# EAGLE design ADC Board(Two Board) (EAGLE 7.6.0)
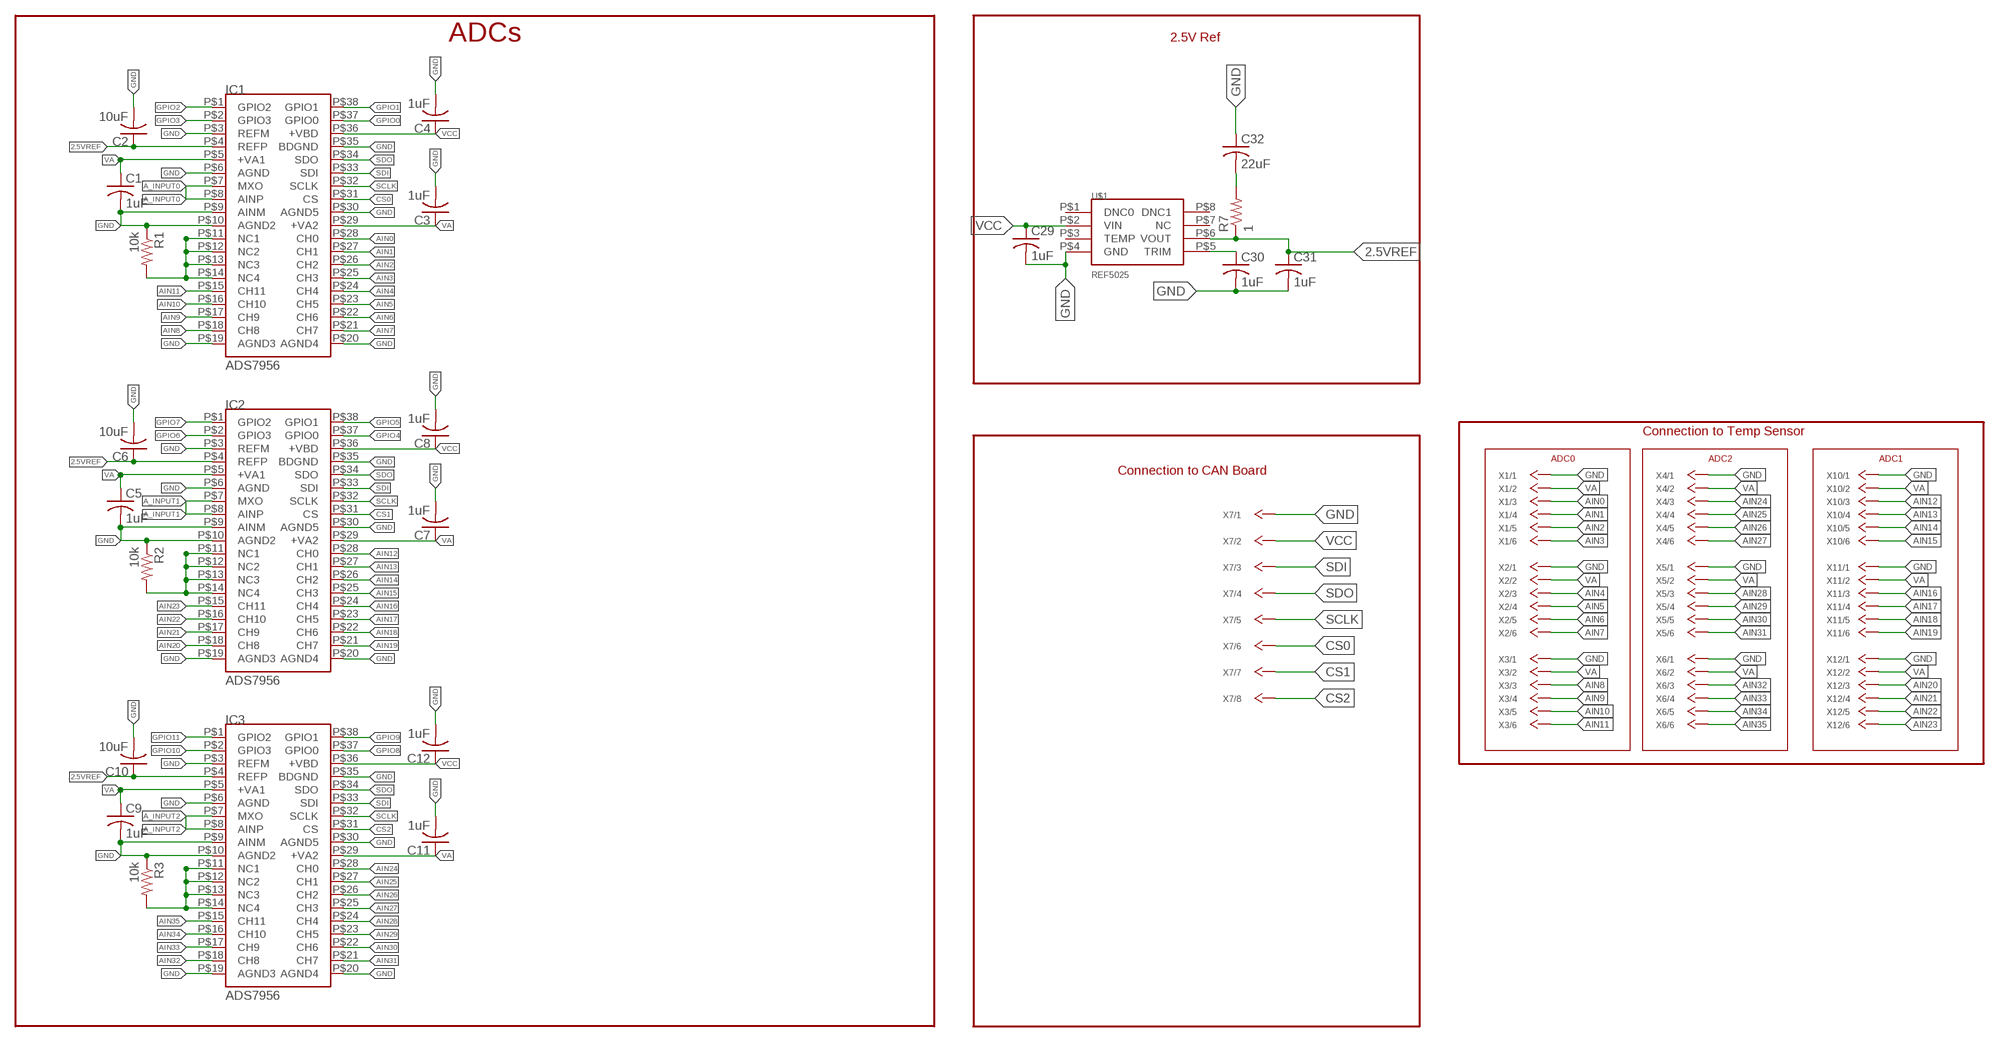
[diagram p0: schematic, sheet 1]

## Parts
C1  1uF  C-USC0603  [C0603]
C2  10uF  C-USC0603  [C0603]
C3  1uF  C-USC0603  [C0603]
C4  1uF  C-USC0603  [C0603]
C5  1uF  C-USC0603  [C0603]
C6  10uF  C-USC0603  [C0603]
C7  1uF  C-USC0603  [C0603]
C8  1uF  C-USC0603  [C0603]
C9  1uF  C-USC0603  [C0603]
C10  10uF  C-USC0603  [C0603]
C11  1uF  C-USC0603  [C0603]
C12  1uF  C-USC0603  [C0603]
C29  1uF  C-USC0603  [C0603]
C30  1uF  C-USC0603  [C0603]
C31  1uF  C-USC0603  [C0603]
C32  22uF  C-USC0603  [C0603]
IC1  ADS7956  [TSSOP-38]
IC2  ADS7956  [TSSOP-38]
IC3  ADS7956  [TSSOP-38]
R1  10k  R-US_R0603  [R0603]
R2  10k  R-US_R0603  [R0603]
R3  10k  R-US_R0603  [R0603]
R7  1  R-US_M0805  [M0805]
U$1  REF5025  [TSSOP-8(TI)]
X1  6_PIN_CONNTE_IDC  [2178710_IDC]
X2  6_PIN_CONNTE_IDC  [2178710_IDC]
X3  6_PIN_CONNTE_IDC  [2178710_IDC]
X4  6_PIN_CONNTE_IDC  [2178710_IDC]
X5  6_PIN_CONNTE_IDC  [2178710_IDC]
X6  6_PIN_CONNTE_IDC  [2178710_IDC]
X7  8_PIN_CONN  [8_PIN_MOLEX]
X10  6_PIN_CONNTE_IDC  [2178710_IDC]
X11  6_PIN_CONNTE_IDC  [2178710_IDC]
X12  6_PIN_CONNTE_IDC  [2178710_IDC]

## Nets
2.5VREF: C2.1 C6.1 C10.1 C31.1 IC1.P$4(REFP) IC2.P$4(REFP) IC3.P$4(REFP) R7.1 U$1.P$6(VOUT)
A_INPUT0: IC1.P$7(MXO) IC1.P$8(AINP)
A_INPUT1: IC2.P$7(MXO) IC2.P$8(AINP)
A_INPUT2: IC3.P$7(MXO) IC3.P$8(AINP)
AIN0: IC1.P$28(CH0) X1.P$3
AIN1: IC1.P$27(CH1) X1.P$4
AIN2: IC1.P$26(CH2) X1.P$5
AIN3: IC1.P$25(CH3) X1.P$6
AIN4: IC1.P$24(CH4) X2.P$3
AIN5: IC1.P$23(CH5) X2.P$4
AIN6: IC1.P$22(CH6) X2.P$5
AIN7: IC1.P$21(CH7) X2.P$6
AIN8: IC1.P$18(CH8) X3.P$3
AIN9: IC1.P$17(CH9) X3.P$4
AIN10: IC1.P$16(CH10) X3.P$5
AIN11: IC1.P$15(CH11) X3.P$6
AIN12: IC2.P$28(CH0) X10.P$3
AIN13: IC2.P$27(CH1) X10.P$4
AIN14: IC2.P$26(CH2) X10.P$5
AIN15: IC2.P$25(CH3) X10.P$6
AIN16: IC2.P$24(CH4) X11.P$3
AIN17: IC2.P$23(CH5) X11.P$4
AIN18: IC2.P$22(CH6) X11.P$5
AIN19: IC2.P$21(CH7) X11.P$6
AIN20: IC2.P$18(CH8) X12.P$3
AIN21: IC2.P$17(CH9) X12.P$4
AIN22: IC2.P$16(CH10) X12.P$5
AIN23: IC2.P$15(CH11) X12.P$6
AIN24: IC3.P$28(CH0) X4.P$3
AIN25: IC3.P$27(CH1) X4.P$4
AIN26: IC3.P$26(CH2) X4.P$5
AIN27: IC3.P$25(CH3) X4.P$6
AIN28: IC3.P$24(CH4) X5.P$3
AIN29: IC3.P$23(CH5) X5.P$4
AIN30: IC3.P$22(CH6) X5.P$5
AIN31: IC3.P$21(CH7) X5.P$6
AIN32: IC3.P$18(CH8) X6.P$3
AIN33: IC3.P$17(CH9) X6.P$4
AIN34: IC3.P$16(CH10) X6.P$5
AIN35: IC3.P$15(CH11) X6.P$6
CS0: IC1.P$31(CS) X7.P$6
CS1: IC2.P$31(CS) X7.P$7
CS2: IC3.P$31(CS) X7.P$8
GND: C1.2 C2.2 C3.2 C4.2 C5.2 C6.2 C7.2 C8.2 C9.2 C10.2 C11.2 C12.2 C29.2 C30.2 C31.2 C32.1 IC1.P$3(REFM) IC1.P$6(AGND) IC1.P$9(AINM) IC1.P$10(AGND2) IC1.P$19(AGND3) IC1.P$20(AGND4) IC1.P$30(AGND5) IC1.P$35(BDGND) IC2.P$3(REFM) IC2.P$6(AGND) IC2.P$9(AINM) IC2.P$10(AGND2) IC2.P$19(AGND3) IC2.P$20(AGND4) IC2.P$30(AGND5) IC2.P$35(BDGND) IC3.P$3(REFM) IC3.P$6(AGND) IC3.P$9(AINM) IC3.P$10(AGND2) IC3.P$19(AGND3) IC3.P$20(AGND4) IC3.P$30(AGND5) IC3.P$35(BDGND) R1.1 R2.1 R3.1 U$1.P$4(GND) X1.P$1 X2.P$1 X3.P$1 X4.P$1 X5.P$1 X6.P$1 X7.P$1 X10.P$1 X11.P$1 X12.P$1
GPIO0: IC1.P$37(GPIO0)
GPIO1: IC1.P$38(GPIO1)
GPIO2: IC1.P$1(GPIO2)
GPIO3: IC1.P$2(GPIO3)
GPIO4: IC2.P$37(GPIO0)
GPIO5: IC2.P$38(GPIO1)
GPIO6: IC2.P$2(GPIO3)
GPIO7: IC2.P$1(GPIO2)
GPIO8: IC3.P$37(GPIO0)
GPIO9: IC3.P$38(GPIO1)
GPIO10: IC3.P$2(GPIO3)
GPIO11: IC3.P$1(GPIO2)
N$3: C32.2 R7.2
NC: IC1.P$11(NC1) IC1.P$12(NC2) IC1.P$13(NC3) IC1.P$14(NC4) R1.2
NC1: IC2.P$11(NC1) IC2.P$12(NC2) IC2.P$13(NC3) IC2.P$14(NC4) R2.2
NC2: IC3.P$11(NC1) IC3.P$12(NC2) IC3.P$13(NC3) IC3.P$14(NC4) R3.2
SCLK: IC1.P$32(SCLK) IC2.P$32(SCLK) IC3.P$32(SCLK) X7.P$5
SDI: IC1.P$33(SDI) IC2.P$33(SDI) IC3.P$33(SDI) X7.P$3
SDO: IC1.P$34(SDO) IC2.P$34(SDO) IC3.P$34(SDO) X7.P$4
TRIM: C30.1 U$1.P$5(TRIM)
VA: C1.1 C3.1 C5.1 C7.1 C9.1 C11.1 IC1.P$5(+VA1) IC1.P$29(+VA2) IC2.P$5(+VA1) IC2.P$29(+VA2) IC3.P$5(+VA1) IC3.P$29(+VA2) X1.P$2 X2.P$2 X3.P$2 X4.P$2 X5.P$2 X6.P$2 X10.P$2 X11.P$2 X12.P$2
VCC: C4.1 C8.1 C12.1 C29.1 IC1.P$36(+VBD) IC2.P$36(+VBD) IC3.P$36(+VBD) U$1.P$2(VIN) X7.P$2
Unconnected: U$1.P$1(DNC0) U$1.P$3(TEMP) U$1.P$7(NC) U$1.P$8(DNC1)

## Notes on the sheet
- ADCs | 2.5V Ref
- Connection to Temp Sensor
- ADC0 | ADC2 | ADC1
- Connection to CAN Board

## Library data of the parts
C1-C12 C29-C32 = adafruit:C-US: CAPACITOR, American symbol
IC1-IC3 = BMS Lbr:ADS7956
R1-R3 = resistor:R-US_: RESISTOR, American symbol
R7 = adafruit:R-US_: RESISTOR, American symbol
U$1 = BMS Lbr:REF5025: 2.5V Voltage Reference
X1-X6 X10-X12 = BMS Lbr:6_PIN_CONN: 6 Pin Connector
X7 = BMS Lbr:8_PIN_CONN

## Board
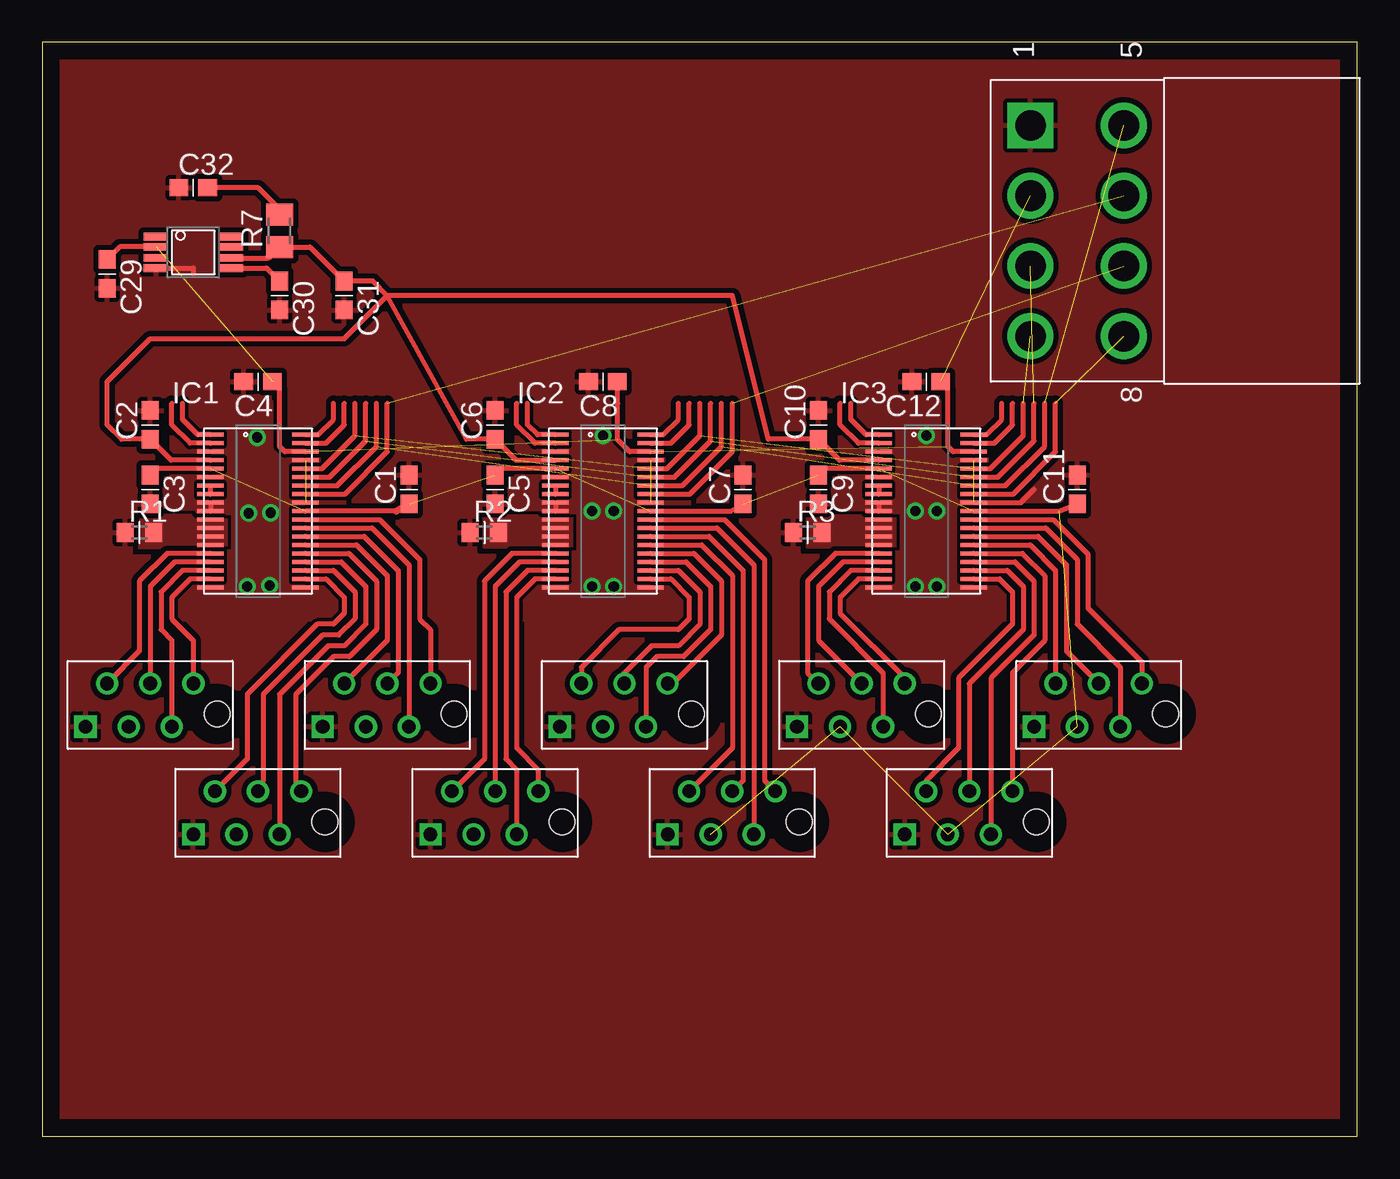
[diagram p1: board, top side]
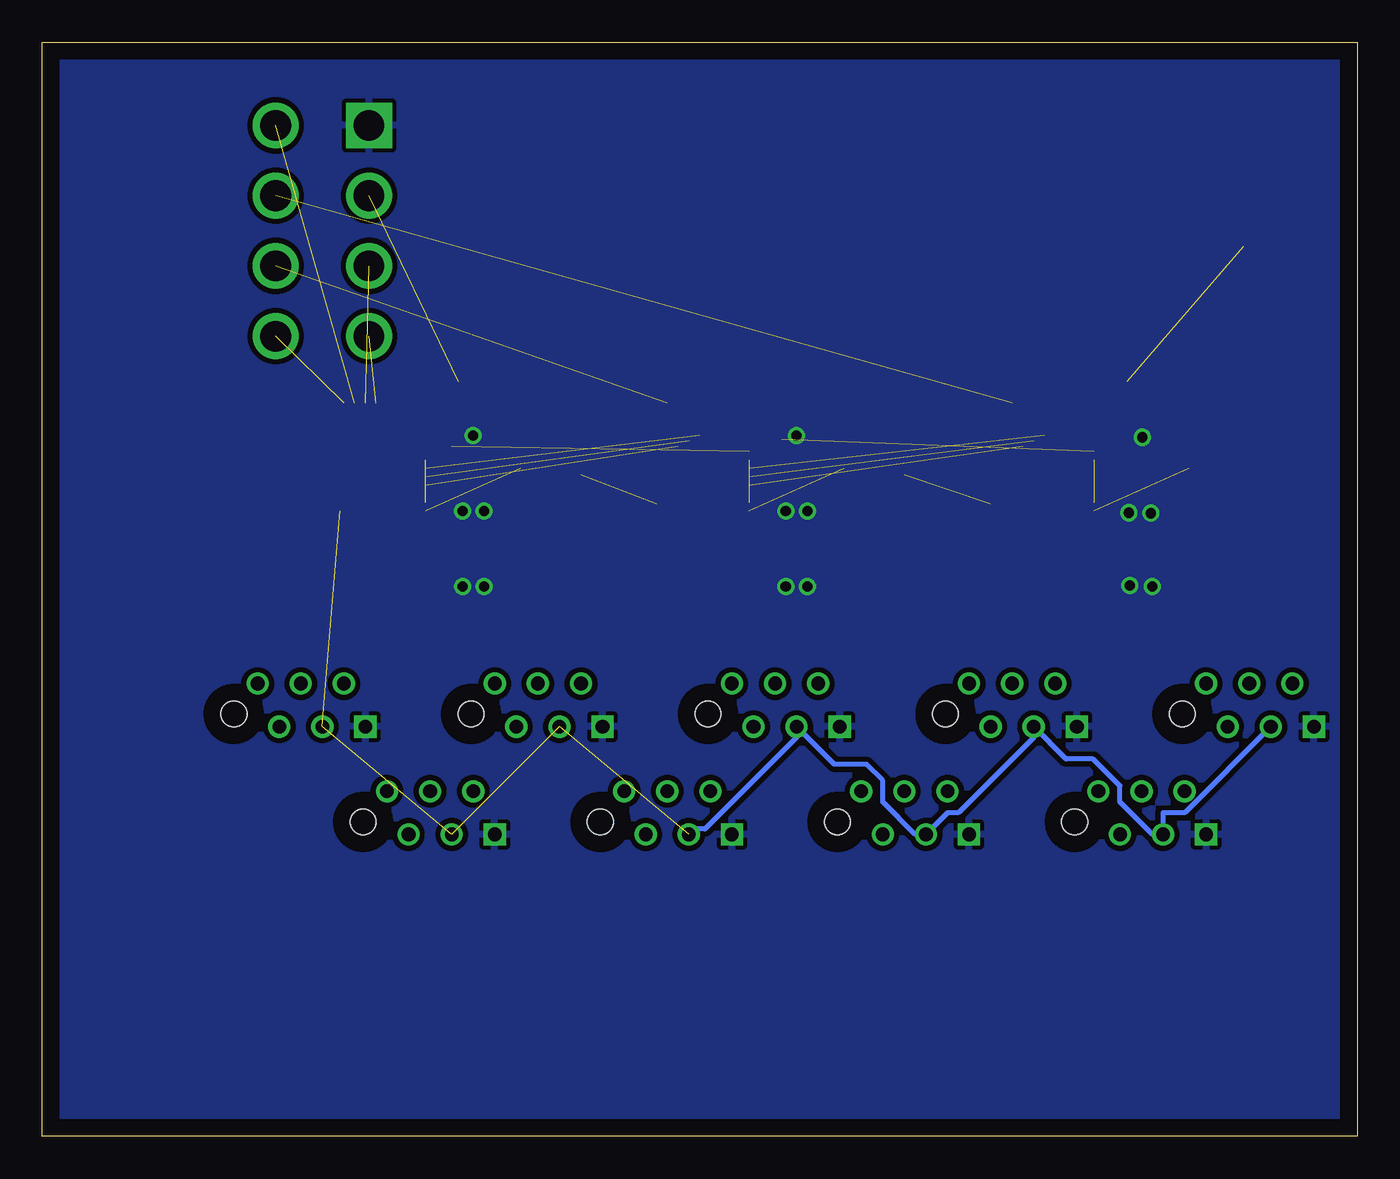
[diagram p2: board, bottom side, seen from below]

Size 77.45 x 64.44 mm. Coordinates in mm from the lower left corner, seen from the top.
Outline: 0,0 77.45,0 77.45,64.44 0,64.44 0,0
Copper layers (1*16): Top 0.035mm / dielectric 1.5mm / Bottom 0.035mm
Design rules "default": minimum track width 10mil, minimum drill 24mil, track to track 8mil, track to pad 8mil, pad to pad 8mil, via to via 8mil, smd to smd 8mil, copper to edge 40mil, drill to drill 8mil, minimum pad ring 10mil, minimum via ring 8mil, stop-mask expansion 4mil, vias tented up to drill 0mil, thermal gap 10mil

### Footprints (pad centres in the part's own frame; a part is rotated, then mirrored left to right if it is on the bottom)
C0603 = smd 1.1 x 1: 1 -0.85,0; 2 0.85,0
TSSOP-38 = smd 1.55 x 0.25: P$1 -2.8,4.5; P$2 -2.8,4; P$3 -2.8,3.5; P$4 -2.8,3; P$5 -2.8,2.5; P$6 -2.8,2; P$7 -2.8,1.5; P$8 -2.8,1; P$9 -2.8,0.5; P$10 -2.8,0; P$11 -2.8,-0.5; P$12 -2.8,-1; P$13 -2.8,-1.5; P$14 -2.8,-2; P$15 -2.8,-2.5; P$16 -2.8,-3; P$17 -2.8,-3.5; P$18 -2.8,-4; P$19 -2.8,-4.5; P$20 2.8,-4.5; P$21 2.8,-4; P$22 2.8,-3.5; P$23 2.8,-3; P$24 2.8,-2.5; P$25 2.8,-2; P$26 2.8,-1.5; P$27 2.8,-1; P$28 2.8,-0.5; P$29 2.8,0; P$30 2.8,0.5; P$31 2.8,1; P$32 2.8,1.5; P$33 2.8,2; P$34 2.8,2.5; P$35 2.8,3; P$36 2.8,3.5; P$37 2.8,4; P$38 2.8,4.5
R0603 = smd 1 x 1.1: 1 -0.85,0; 2 0.85,0
M0805 = smd 1.3 x 1.6: 1 -0.95,0; 2 0.95,0
TSSOP-8(TI) = smd 0.45 x 1.45: P$1 -0.925,-2.2; P$2 -0.325,-2.2; P$3 0.325,-2.2; P$4 0.925,-2.2; P$5 0.925,2.2; P$6 0.325,2.2; P$7 -0.325,2.2; P$8 -0.925,2.2
2178710_IDC = drill 0.8 square: P$1 -3.81,-2.54 | drill 0.8: P$2 -1.27,-2.54; P$3 2.54,0; P$4 1.27,-2.54; P$5 0,0; P$6 -2.54,0 | hole 1.5: 3.94,-1.8
8_PIN_MOLEX = drill 1.8 square: P$1 6.21,2.75 | drill 1.8: P$2 2.07,2.75; P$3 -2.07,2.75; P$4 -6.21,2.75; P$5 6.21,-2.75; P$6 2.07,-2.75; P$7 -2.07,-2.75; P$8 -6.21,-2.75

### Placement (x,y rotation side)
C1  21.59,38.1 90 top
C2  6.35,41.91 90 top
C3  6.35,38.1 270 top
C4  12.7,44.45 180 top
C5  26.67,38.1 270 top
C6  26.67,41.91 90 top
C7  41.27,38.1 90 top
C8  33.02,44.45 180 top
C9  45.72,38.1 270 top
C10  45.72,41.91 90 top
C11  60.96,38.1 90 top
C12  52.07,44.45 180 top
C29  3.81,50.8 270 top
C30  13.97,49.53 270 top
C31  17.78,49.53 270 top
C32  8.89,55.88 0 top
IC1  12.7,36.83 0 top
IC2  33.02,36.83 0 top
IC3  52.07,36.83 0 top
R1  5.71,35.56 0 top
R2  26.04,35.56 0 top
R3  45.09,35.56 0 top
R7  13.97,53.34 90 top
U$1  8.89,52.07 270 top
X1  20.32,26.67 0 top
X2  12.7,20.32 0 top
X3  6.35,26.67 0 top
X4  62.23,26.67 0 top
X5  54.61,20.32 0 top
X6  48.26,26.67 0 top
X7  60.96,53.34 90 top
X10  40.64,20.32 0 top
X11  34.29,26.67 0 top
X12  26.67,20.32 0 top

### Tracks (layer width: path | path; a pad name or v marks a point on that pad's centre or on a via)
2.5VREF
  Top 0.305: IC1.P$4 7.58,39.83 C2.1 4.66,41.06 3.81,41.91 3.81,44.45 6.35,46.99 17.78,46.99 20.32,49.53 | IC2.P$4 27.9,39.83 C6.1 24.98,41.06 20.32,49.53 | IC3.P$4 46.95,39.83 C10.1 42.76,41.06 40.64,49.53 20.32,49.53 | U$1.P$6 13.32,51.74 R7.1 15.77,52.39 C31.1 19.47,50.38 20.32,49.53
A_INPUT0
  Top 0.305: IC1.P$8 IC1.P$7
A_INPUT1
  Top 0.305: IC2.P$7 IC2.P$8
A_INPUT2
  Top 0.305: IC3.P$7 IC3.P$8
AIN0
  Top 0.305: IC1.P$28 19.87,36.33 22.23,33.97 22.23,30.48 22.86,29.84 X1.P$3
AIN1
  Top 0.305: IC1.P$27 19.41,35.83 21.59,33.66 X1.P$4
AIN2
  Top 0.305: IC1.P$26 18.96,35.33 20.95,33.34 20.95,27.3 X1.P$5
AIN3
  Top 0.305: IC1.P$25 18.51,34.83 20.32,33.02 20.32,29.21 X1.P$6
AIN4
  Top 0.305: IC1.P$24 18.06,34.33 19.68,32.7 19.68,29.84 18.1,28.26 17.14,28.26 14.92,26.04 14.92,20.64 X2.P$3
AIN5
  Top 0.305: IC1.P$23 17.61,33.83 19.05,32.38 19.05,30.16 17.78,28.89 16.83,28.89 13.97,26.04 X2.P$4
AIN6
  Top 0.305: IC1.P$22 17.15,33.33 18.41,32.07 18.41,30.48 17.46,29.53 16.51,29.53 13.02,26.04 13.02,20.95 12.7,20.64 X2.P$5
AIN7
  Top 0.305: IC1.P$21 16.7,32.83 17.78,31.75 17.78,30.8 17.14,30.16 16.19,30.16 12.06,26.04 12.06,22.23 X2.P$6
AIN8
  Top 0.305: IC1.P$18 8.7,32.83 7.62,31.75 7.62,30.48 8.89,29.21 X3.P$3
AIN9
  Top 0.305: IC1.P$17 8.25,33.33 6.99,32.07 6.99,29.84 7.62,29.21 X3.P$4
AIN10
  Top 0.305: IC1.P$16 7.79,33.83 6.35,32.38 X3.P$5
AIN11
  Top 0.305: IC1.P$15 7.34,34.33 5.71,32.7 5.71,28.57 X3.P$6
AIN12
  Top 0.305: IC2.P$28 40.19,36.33 42.55,33.97 42.55,20.95 X10.P$3
AIN13
  Top 0.305: IC2.P$27 39.73,35.83 41.91,33.66 X10.P$4
AIN14
  Top 0.305: IC2.P$26 39.28,35.33 41.27,33.34 41.27,20.95 X10.P$5
AIN15
  Top 0.305: IC2.P$25 38.83,34.83 40.64,33.02 40.64,22.86 X10.P$6
AIN16
  Top 0.305: IC2.P$24 38.38,34.33 40.01,32.7 40.01,29.53 37.15,26.67 X11.P$3
AIN17
  Top 0.305: IC2.P$23 37.92,33.83 39.37,32.38 39.37,29.84 37.78,28.26 36.2,28.26 35.56,27.62 X11.P$4
AIN18
  Top 0.305: IC2.P$22 37.47,33.33 38.73,32.07 38.73,30.16 37.47,28.89 35.88,28.89 34.29,27.3 X11.P$5
AIN19
  Top 0.305: IC2.P$21 37.02,32.83 38.1,31.75 38.1,30.48 37.47,29.84 33.97,29.84 31.75,27.62 X11.P$6
AIN20
  Top 0.305: IC2.P$18 29.02,32.83 27.94,31.75 27.94,22.86 29.21,21.59 X12.P$3
AIN21
  Top 0.305: IC2.P$17 28.57,33.33 27.3,32.07 27.3,22.23 27.94,21.59 X12.P$4
AIN22
  Top 0.305: IC2.P$16 28.11,33.83 26.67,32.38 X12.P$5
AIN23
  Top 0.305: IC2.P$15 27.66,34.33 26.04,32.7 26.04,22.23 X12.P$6
AIN24
  Top 0.305: IC3.P$28 59.55,36.33 61.59,34.29 61.59,31.11 64.77,27.94 X4.P$3
AIN25
  Top 0.305: IC3.P$27 59.1,35.83 60.96,33.97 60.96,30.16 63.5,27.62 X4.P$4
AIN26
  Top 0.305: IC3.P$26 58.65,35.33 60.33,33.66 60.33,28.57 X4.P$5
AIN27
  Top 0.305: IC3.P$25 58.2,34.83 59.69,33.34 X4.P$6
AIN28
  Top 0.305: IC3.P$24 57.74,34.33 59.05,33.02 59.05,29.21 57.15,27.3 X5.P$3
AIN29
  Top 0.305: IC3.P$23 57.29,33.83 58.42,32.7 58.42,29.53 55.88,26.99 X5.P$4
AIN30
  Top 0.305: IC3.P$22 56.84,33.33 57.78,32.38 57.78,29.84 54.61,26.67 X5.P$5
AIN31
  Top 0.305: IC3.P$21 56.39,32.83 57.15,32.07 57.15,30.16 53.98,26.99 53.98,22.86 52.07,20.95 X5.P$6
AIN32
  Top 0.305: IC3.P$18 48.07,32.83 46.99,31.75 46.99,30.8 50.8,26.99 X6.P$3
AIN33
  Top 0.305: IC3.P$17 47.62,33.33 46.35,32.07 46.35,30.48 49.53,27.3 X6.P$4
AIN34
  Top 0.305: IC3.P$16 47.16,33.83 45.72,32.38 45.72,29.21 X6.P$5
AIN35
  Top 0.305: IC3.P$15 46.71,34.33 45.09,32.7 45.09,27.3 X6.P$6
CS0  (1 unrouted)
  Top 0.305: IC1.P$31 17.83,37.83 20.32,40.32 20.32,43.18
CS1  (1 unrouted)
  Top 0.305: IC2.P$31 38.15,37.83 40.64,40.32 40.64,43.18
CS2  (1 unrouted)
  Top 0.305: IC3.P$31 57.2,37.83 59.69,40.32 59.69,43.18
GND  (via drill 0.6)  (3 unrouted)
  Top 0.305: IC2.P$9 IC2.P$10 | IC3.P$9 IC3.P$10 | IC1.P$9 IC1.P$10 | U$1.P$4 8.89,51.15 8.89,50.8 | IC3.P$30 57.65,37.33 58.42,38.1
  other vias: 12.06,32.38 13.39,32.44 12.14,36.7 13.44,36.73 12.65,41.17 32.38,32.38 33.66,32.38 32.38,36.83 33.66,36.83 33.02,41.27 51.44,32.38 52.7,32.38 52.7,36.83 51.44,36.83 52.07,41.27
  pour Top (rank 6, no thermals): 7.62,30.48 17.78,30.48 17.78,43.18 7.62,43.18
  pour Bottom (isolate 0.305, rank 6): 0,0 77.47,0 77.47,64.77 0,64.77
  pour Top (isolate 0.305, rank 5): 0,0 77.47,0 77.47,64.77 0,64.77
  pour Top (rank 6, no thermals): 27.94,30.48 38.1,30.48 38.1,43.18 27.94,43.18
  pour Top (rank 6, no thermals): 46.99,30.48 57.15,30.48 57.15,43.18 46.99,43.18
GPIO0
  Top 0.305: IC1.P$37 16.7,40.83 17.78,41.91 17.78,43.18
GPIO1
  Top 0.305: IC1.P$38 16.25,41.33 17.14,42.23 17.14,43.18
GPIO2
  Top 0.305: IC1.P$1 9.15,41.33 8.26,42.23 8.26,43.18
GPIO3
  Top 0.305: IC1.P$2 8.7,40.83 7.62,41.91 7.62,43.18
GPIO4
  Top 0.305: IC2.P$37 37.02,40.83 38.1,41.91 38.1,43.18
GPIO5
  Top 0.305: IC2.P$38 36.57,41.33 37.47,42.23 37.47,43.18
GPIO6
  Top 0.305: IC2.P$2 29.02,40.83 27.94,41.91 27.94,43.18
GPIO7
  Top 0.305: IC2.P$1 29.16,41.33 28.57,41.91 28.57,43.18
GPIO8
  Top 0.305: IC3.P$37 56.07,40.83 57.15,41.91 57.15,43.18
GPIO9
  Top 0.305: IC3.P$38 55.62,41.33 56.52,42.23 56.52,43.18
GPIO10
  Top 0.305: IC3.P$2 48.07,40.83 46.99,41.91 46.99,43.18
GPIO11
  Top 0.305: IC3.P$1 48.52,41.33 47.62,42.23 47.62,43.18
N$3
  Top 0.305: R7.2 13.97,54.61 12.7,55.88 C32.2
NC
  pour Top (isolate 0.305, no thermals): 5.46,34.75 10.79,34.75 10.79,36.5 5.51,36.5
NC1
  pour Top (isolate 0.254, no thermals): 31.11,34.75 26.04,34.75 26.04,36.5 31.11,36.5
NC2
  pour Top (isolate 0.254, no thermals): 45.09,36.5 50.16,36.5 50.16,34.75 45.09,34.75
SCLK  (3 unrouted)
  Top 0.305: IC3.P$32 56.74,38.33 59.05,40.64 59.05,43.18 | IC2.P$32 37.7,38.33 40.01,40.64 40.01,43.18 | IC1.P$32 17.38,38.33 19.68,40.64 19.68,43.18
SDI  (3 unrouted)
  Top 0.305: IC3.P$33 56.29,38.83 58.42,40.96 58.42,43.18 | IC2.P$33 37.24,38.83 39.37,40.96 39.37,43.18 | IC1.P$33 16.92,38.83 19.05,40.96 19.05,43.18
SDO  (3 unrouted)
  Top 0.305: IC3.P$34 55.84,39.33 57.78,41.27 57.78,43.18 | IC2.P$34 36.79,39.33 38.73,41.27 38.73,43.18 | IC1.P$34 16.47,39.33 18.41,41.27 18.41,43.18
TRIM
  Top 0.305: U$1.P$5 13.21,51.15 C30.1
VA  (9 unrouted)
  Top 0.305: 20.85,36.83 IC1.P$29 | IC1.P$5 6.73,39.33 | IC2.P$5 27.05,39.33 C5.1 | IC2.P$29 40.54,36.83 C7.1 | IC3.P$29 59.91,36.83 C11.1 | IC3.P$5 46.1,39.33 C9.1
  Top 0.406: C1.1 20.85,36.83 | 6.73,39.33 C3.1
  Bottom 0.305: X3.P$2 10.16,19.05 11.43,19.05 X2.P$2 12.06,17.78 13.97,19.68 13.97,20.64 15.56,22.23 17.14,22.23 X1.P$2 19.05,23.5 23.5,19.05 24.13,19.05 X12.P$2 26.04,17.78 27.94,19.68 27.94,20.95 28.89,21.91 30.8,21.91 X11.P$2 33.02,23.5 38.42,18.1 39.05,18.1 X10.P$2
VCC  (4 unrouted)
  Top 0.305: U$1.P$2 4.55,52.4 C29.1 | IC2.P$36 34.6,40.33 33.88,41.05 33.88,43.17 C8.1 | IC3.P$36 53.65,40.33 53.34,40.64 53.34,44.03 C12.1 | IC1.P$36 14.28,40.33 13.97,40.64 13.97,44.03 C4.1